# EAGLE design Quad VCA MAIN v1 (EAGLE 7.7.0)
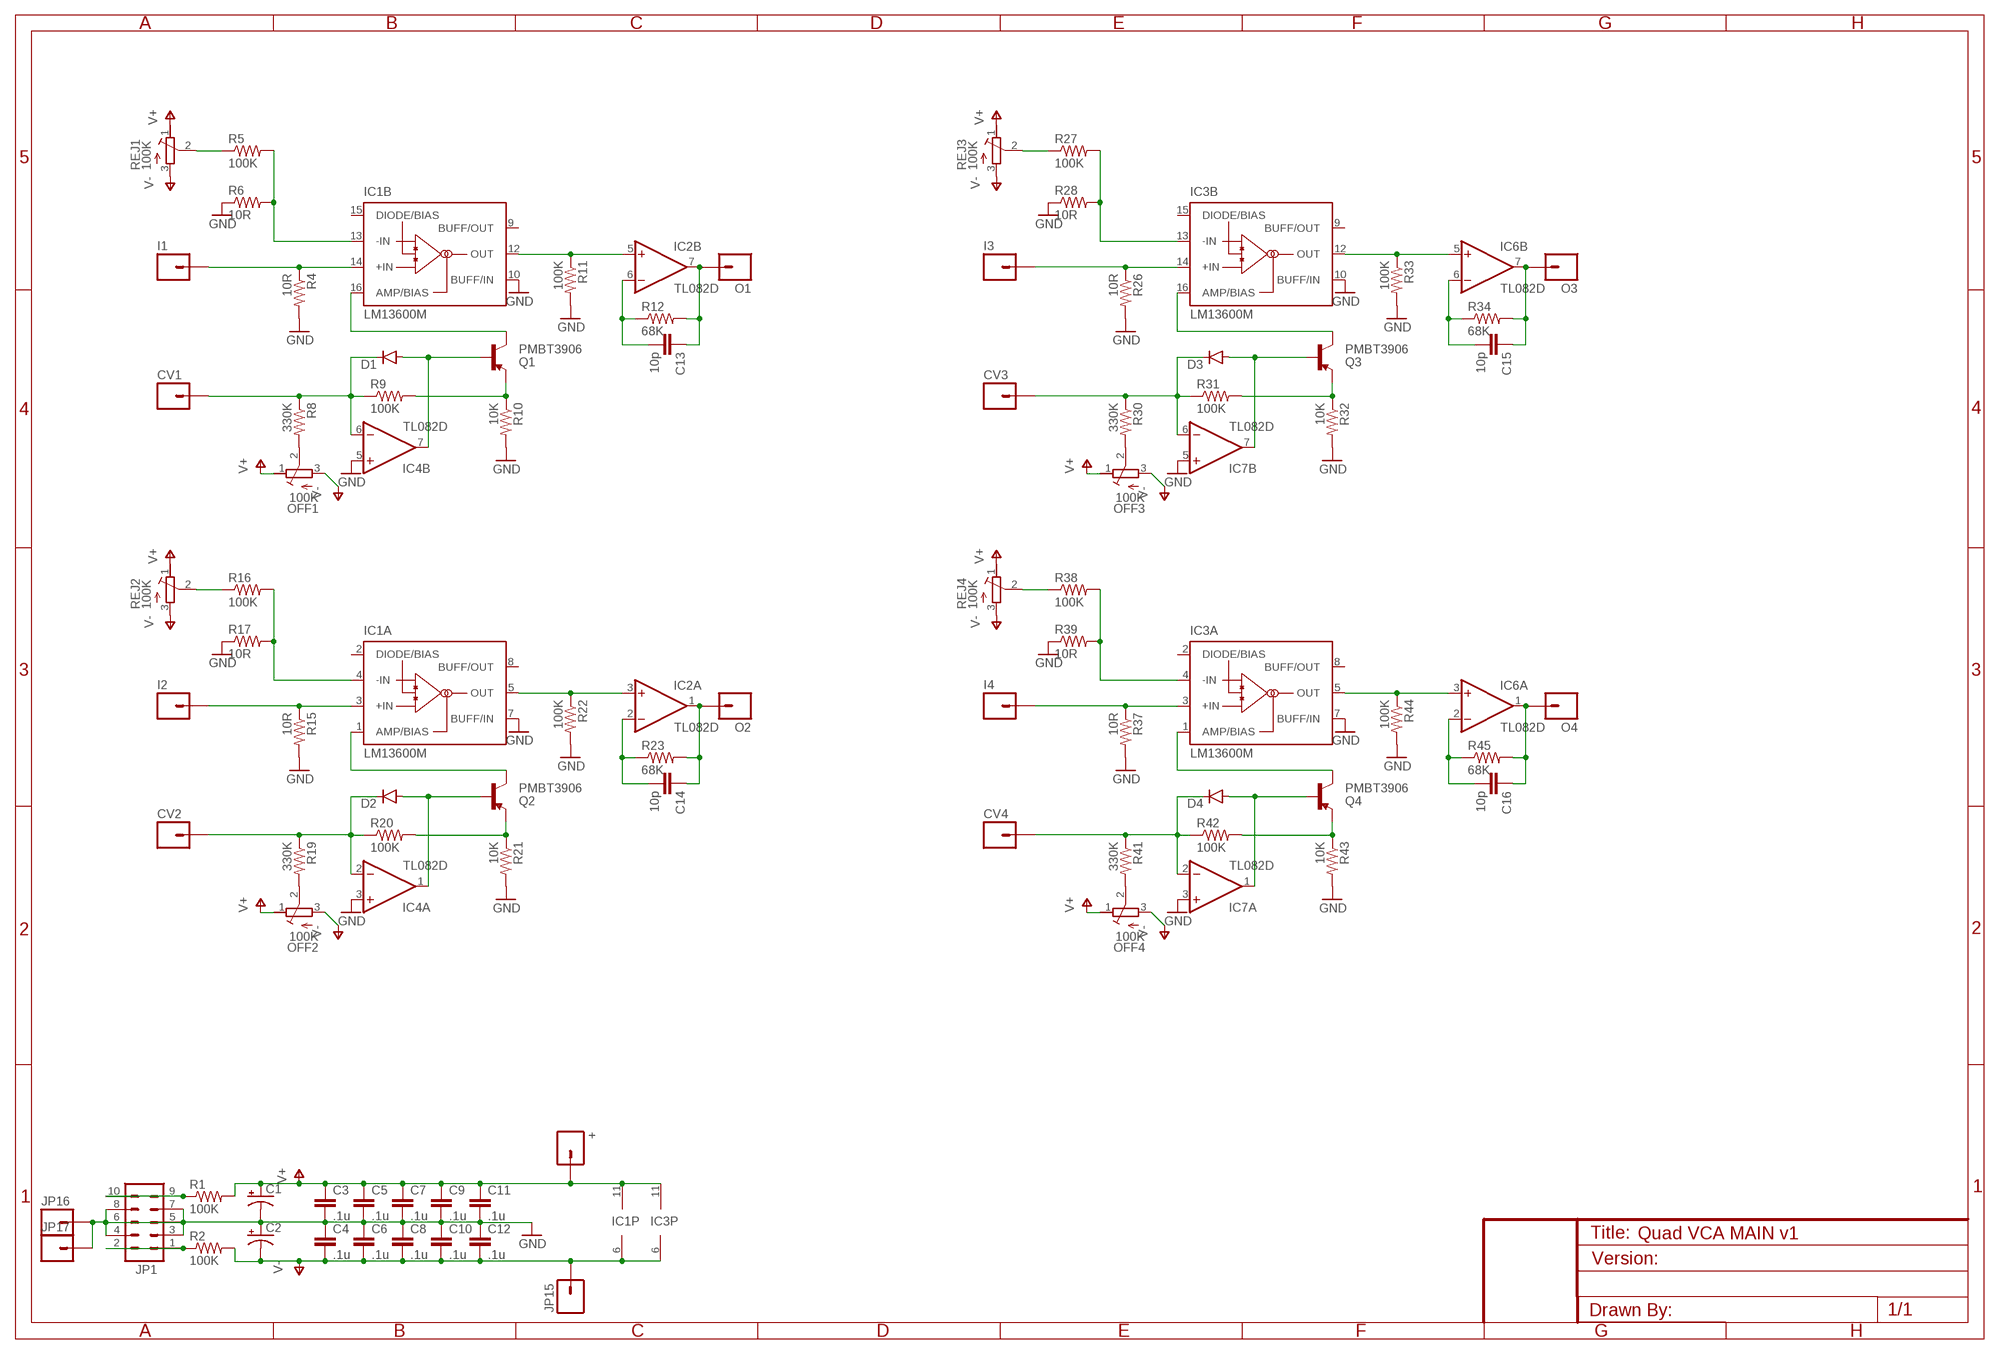
[diagram p0: schematic, sheet 1]

## Parts
+  M01PTH  [1X01]
C1  CAP_POLPTH2  [CPOL-RADIAL-10UF-25V]
C2  CAP_POLPTH2  [CPOL-RADIAL-10UF-25V]
C3  .1u  CAP0805  [0805]
C4  .1u  CAP0805  [0805]
C5  .1u  CAP0805  [0805]
C6  .1u  CAP0805  [0805]
C7  .1u  CAP0805  [0805]
C8  .1u  CAP0805  [0805]
C9  .1u  CAP0805  [0805]
C10  .1u  CAP0805  [0805]
C11  .1u  CAP0805  [0805]
C12  .1u  CAP0805  [0805]
C13  10p  CAP0805  [0805]
C14  10p  CAP0805  [0805]
C15  10p  CAP0805  [0805]
C16  10p  CAP0805  [0805]
CV1  M01PTH  [1X01]
CV2  M01PTH  [1X01]
CV3  M01PTH  [1X01]
CV4  M01PTH  [1X01]
D1  DIODESOD123  [SOD-123]
D2  DIODESOD123  [SOD-123]
D3  DIODESOD123  [SOD-123]
D4  DIODESOD123  [SOD-123]
I1  M01PTH  [1X01]
I2  M01PTH  [1X01]
I3  M01PTH  [1X01]
I4  M01PTH  [1X01]
IC1  LM13600M  [SO16]
IC2  TL082D  [SO08]
IC3  LM13600M  [SO16]
IC4  TL082D  [SO08]
IC6  TL082D  [SO08]
IC7  TL082D  [SO08]
JP1  M05X2PTH  [AVR_ICSP]
JP15  M01PTH  [1X01]
JP16  M01PTH  [1X01]
JP17  M01PTH  [1X01]
O1  M01PTH  [1X01]
O2  M01PTH  [1X01]
O3  M01PTH  [1X01]
O4  M01PTH  [1X01]
OFF1  100K  R-TRIMM3314G  [RTRIM3314G]
OFF2  100K  R-TRIMM3314G  [RTRIM3314G]
OFF3  100K  R-TRIMM3314G  [RTRIM3314G]
OFF4  100K  R-TRIMM3314G  [RTRIM3314G]
Q1  PMBT3906  TRANSISTOR_PNPPMBT3906  [SOT23-3]
Q2  PMBT3906  TRANSISTOR_PNPPMBT3906  [SOT23-3]
Q3  PMBT3906  TRANSISTOR_PNPPMBT3906  [SOT23-3]
Q4  PMBT3906  TRANSISTOR_PNPPMBT3906  [SOT23-3]
R1  100K  RESISTOR0805-RES  [0805]
R2  100K  RESISTOR0805-RES  [0805]
R4  10R  RESISTOR0805-RES  [0805]
R5  100K  RESISTOR0805-RES  [0805]
R6  10R  RESISTOR0805-RES  [0805]
R8  330K  RESISTOR0805-RES  [0805]
R9  100K  RESISTOR0805-RES  [0805]
R10  10K  RESISTOR0805-RES  [0805]
R11  100K  RESISTOR0805-RES  [0805]
R12  68K  RESISTOR0805-RES  [0805]
R15  10R  RESISTOR0805-RES  [0805]
R16  100K  RESISTOR0805-RES  [0805]
R17  10R  RESISTOR0805-RES  [0805]
R19  330K  RESISTOR0805-RES  [0805]
R20  100K  RESISTOR0805-RES  [0805]
R21  10K  RESISTOR0805-RES  [0805]
R22  100K  RESISTOR0805-RES  [0805]
R23  68K  RESISTOR0805-RES  [0805]
R26  10R  RESISTOR0805-RES  [0805]
R27  100K  RESISTOR0805-RES  [0805]
R28  10R  RESISTOR0805-RES  [0805]
R30  330K  RESISTOR0805-RES  [0805]
R31  100K  RESISTOR0805-RES  [0805]
R32  10K  RESISTOR0805-RES  [0805]
R33  100K  RESISTOR0805-RES  [0805]
R34  68K  RESISTOR0805-RES  [0805]
R37  10R  RESISTOR0805-RES  [0805]
R38  100K  RESISTOR0805-RES  [0805]
R39  10R  RESISTOR0805-RES  [0805]
R41  330K  RESISTOR0805-RES  [0805]
R42  100K  RESISTOR0805-RES  [0805]
R43  10K  RESISTOR0805-RES  [0805]
R44  100K  RESISTOR0805-RES  [0805]
R45  68K  RESISTOR0805-RES  [0805]
REJ1  100K  R-TRIMM3314G  [RTRIM3314G]
REJ2  100K  R-TRIMM3314G  [RTRIM3314G]
REJ3  100K  R-TRIMM3314G  [RTRIM3314G]
REJ4  100K  R-TRIMM3314G  [RTRIM3314G]

## Nets
GND: C1.2(-) C2.1(+) C3.2 C4.1 C5.2 C6.1 C7.2 C8.1 C9.2 C10.1 C11.2 C12.1 IC1.7(A:BUFF/IN) IC1.10(B:BUFF/IN) IC3.7(A:BUFF/IN) IC3.10(B:BUFF/IN) IC4.3(A:+IN) IC4.5(B:+IN) IC7.3(A:+IN) IC7.5(B:+IN) JP1.3 JP1.4 JP1.5 JP1.6 JP1.7 JP1.8 JP16.1 JP17.1 R4.2 R6.1 R10.2 R11.2 R15.2 R17.1 R21.2 R22.2 R26.2 R28.1 R32.2 R33.2 R37.2 R39.1 R43.2 R44.2
N$2: JP1.9 JP1.10 R1.1
N$4: I1.1 IC1.14(B:+IN) R4.1
N$5: JP1.1 JP1.2 R2.1
N$12: I2.1 IC1.3(A:+IN) R15.1
N$13: R16.1 REJ2.2(S)
N$14: IC1.4(A:-IN) R16.2 R17.2
N$15: OFF2.2(S) R19.2
N$16: CV2.1 D2.C IC4.2(A:-IN) R19.1 R20.1
N$17: Q2.2(E) R20.2 R21.1
N$18: D2.A IC4.1(A:OUT) Q2.1(B)
N$21: IC1.1(A:AMP/BIAS) Q2.3(C)
N$22: IC1.5(A:OUT) IC2.3(A:+IN) R22.1
N$23: C14.2 IC2.2(A:-IN) R23.1
N$24: C14.1 IC2.1(A:OUT) O2.1 R23.2
N$27: I3.1 IC3.14(B:+IN) R26.1
N$28: R27.1 REJ3.2(S)
N$29: IC3.13(B:-IN) R27.2 R28.2
N$30: OFF3.2(S) R30.2
N$31: CV3.1 D3.C IC7.6(B:-IN) R30.1 R31.1
N$32: Q3.2(E) R31.2 R32.1
N$33: D3.A IC7.7(B:OUT) Q3.1(B)
N$36: IC3.16(B:AMP/BIAS) Q3.3(C)
N$37: IC3.12(B:OUT) IC6.5(B:+IN) R33.1
N$38: C15.2 IC6.6(B:-IN) R34.1
N$39: R5.1 REJ1.2(S)
N$40: IC1.13(B:-IN) R5.2 R6.2
N$41: OFF1.2(S) R8.2
N$43: CV1.1 D1.C IC4.6(B:-IN) R8.1 R9.1
N$44: Q1.2(E) R9.2 R10.1
N$45: D1.A IC4.7(B:OUT) Q1.1(B)
N$47: IC1.16(B:AMP/BIAS) Q1.3(C)
N$48: IC1.12(B:OUT) IC2.5(B:+IN) R11.1
N$49: C13.2 IC2.6(B:-IN) R12.1
N$50: C13.1 IC2.7(B:OUT) O1.1 R12.2
N$52: C15.1 IC6.7(B:OUT) O3.1 R34.2
N$55: I4.1 IC3.3(A:+IN) R37.1
N$56: R38.1 REJ4.2(S)
N$57: IC3.4(A:-IN) R38.2 R39.2
N$58: OFF4.2(S) R41.2
N$59: CV4.1 D4.C IC7.2(A:-IN) R41.1 R42.1
N$60: Q4.2(E) R42.2 R43.1
N$61: D4.A IC7.1(A:OUT) Q4.1(B)
N$64: IC3.1(A:AMP/BIAS) Q4.3(C)
N$65: IC3.5(A:OUT) IC6.3(A:+IN) R44.1
N$66: C16.2 IC6.2(A:-IN) R45.1
N$67: C16.1 IC6.1(A:OUT) O4.1 R45.2
V+: +.1 C1.1(+) C3.1 C5.1 C7.1 C9.1 C11.1 IC1.11(P:V+) IC3.11(P:V+) OFF1.1(E) OFF2.1(E) OFF3.1(E) OFF4.1(E) R1.2 REJ1.1(E) REJ2.1(E) REJ3.1(E) REJ4.1(E)
V-: C2.2(-) C4.2 C6.2 C8.2 C10.2 C12.2 IC1.6(P:V-) IC3.6(P:V-) JP15.1 OFF1.3(A) OFF2.3(A) OFF3.3(A) OFF4.3(A) R2.2 REJ1.3(A) REJ2.3(A) REJ3.3(A) REJ4.3(A)
Unconnected: IC1.2(A:DIODE/BIAS) IC1.8(A:BUFF/OUT) IC1.9(B:BUFF/OUT) IC1.15(B:DIODE/BIAS) IC3.2(A:DIODE/BIAS) IC3.8(A:BUFF/OUT) IC3.9(B:BUFF/OUT) IC3.15(B:DIODE/BIAS)

## Power pins joined to a net without a drawn wire
V+: IC2.8(P:V+) IC4.8(P:V+) IC6.8(P:V+) IC7.8(P:V+)
V-: IC2.4(P:V-) IC4.4(P:V-) IC6.4(P:V-) IC7.4(P:V-)

## Library data of the parts
+ CV1-CV4 I1-I4 JP15-JP17 O1-O4 = SparkFun-Connectors:M01: Header 1 Standard 1-pin 0.1" header. Use with straight break away headers (SKU : PRT-00116), right angle break away headers (PRT-00553), swiss pins (PRT-00743), machine pins (PRT-00117), and female headers (PRT-00115).
C1 C2 = SparkFun-Passives:CAP_POL: Capacitor Polarized These are standard SMD and PTH capacitors. Normally 10uF, 47uF, and 100uF in electrolytic and tantalum varieties. Always verify the external diameter of the through hole cap, it varies with capacity, voltage, and manufacturer. The EIA devices should be standard.
C3-C16 = SparkFun-Capacitors:CAP: Capacitor Standard 0603 ceramic capacitor, and 0.1" leaded capacitor.
D1-D4 = SparkFun-DiscreteSemi:DIODE: Diode These are standard reverse protection diodes and small signal diodes. SMA package can handle up to about 1A. SOD-323 can handle about 200mA. What the SOD-323 package when ordering, there are some mfgs out there that are 5-pin packages.
IC1 IC3 = national-semiconductor:LM13600: Dual Operational Transconductance Amplifiers with Linearizing Diodes and Buffers Source: lm13600.PDF
IC2 IC4 IC6 IC7 = linear:TL082: OP AMP Data sheet <http://www.ti.com/lit/ds/symlink/tl084a . pdf>; DATA_SHEET: <a href="http://www.ti.com/lit/ds/symlink/tl084a.pdf"> Data sheet </a>
JP1 = SparkFun-Connectors:M05X2: Header 5x2 Standard 10-pin dual row 0.1" header. Commonly used with AVR-ISP. Use with Spark Fun Electronics SKU: PRT-00778
OFF1-OFF4 REJ1-REJ4 = rcl:R-TRIMM: Trimm resistor
Q1-Q4 = SparkFun-DiscreteSemi:TRANSISTOR_PNP: Generic PNP BJT Double check pinouts against datasheets- not all devices are the same! MMBT3906 - 40V 200mA SOT-23 (TRANS-08052) MMBT4403 - 40V 600mA SOT-23 (TRANS-09245); PROD_ID: TRANS-08052
R1 R2 R4-R6 R8-R12 R15-R17 R19-R23 R26-R28 R30-R34 R37-R39 R41-R45 = SparkFun-Resistors:RESISTOR: Resistor Basic schematic elements and footprints for 0603, 1206, and PTH resistors.

## Board
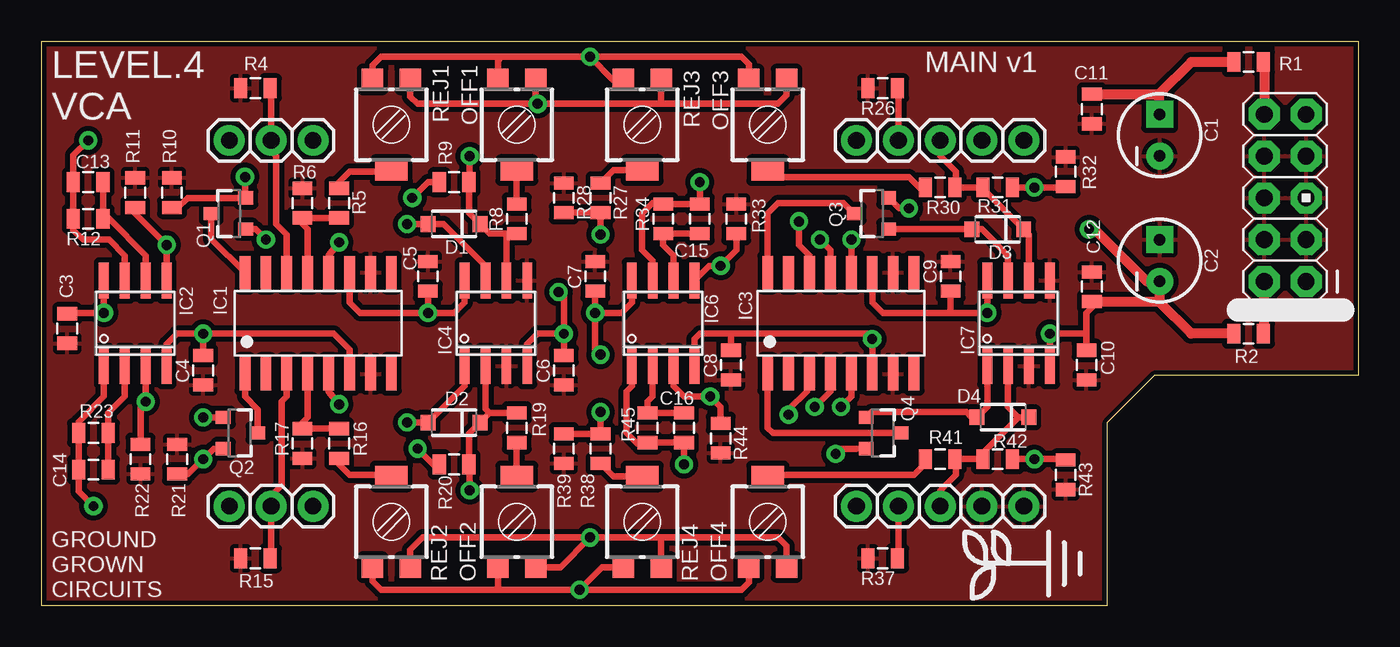
[diagram p1: board, top side]
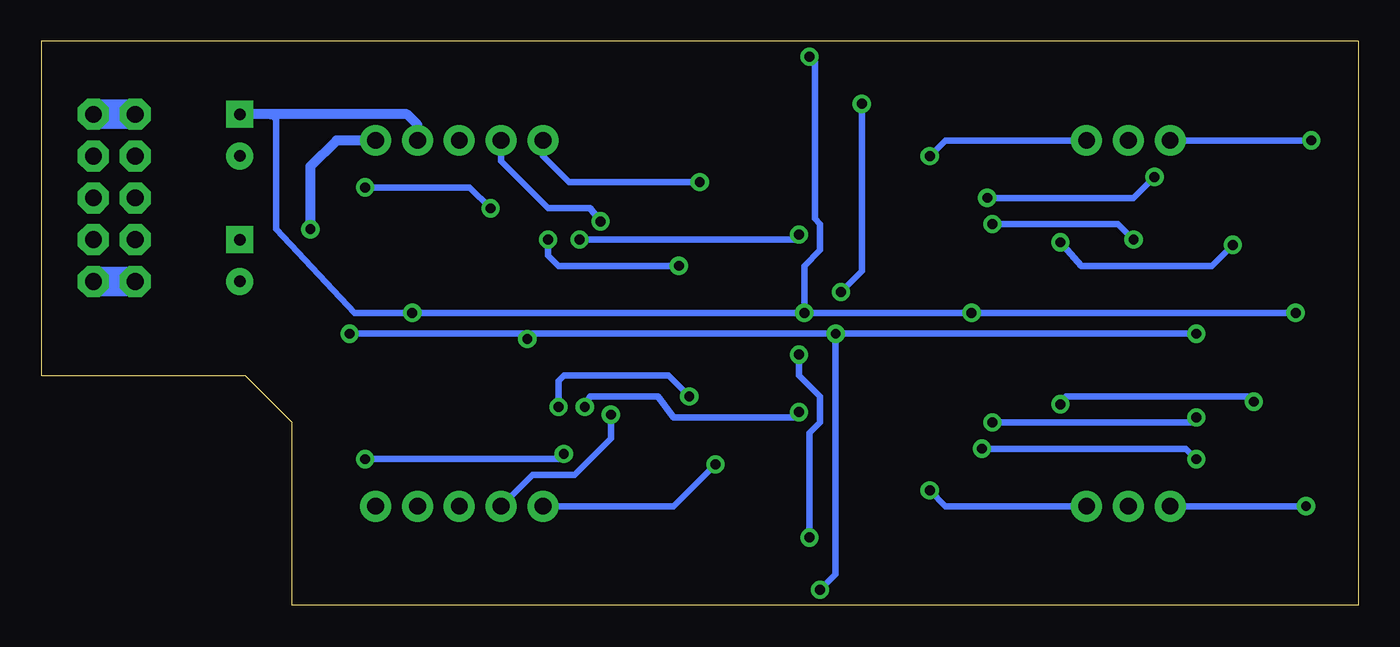
[diagram p2: board, bottom side, seen from below]

Size 80.01 x 34.29 mm. Coordinates in mm from the lower left corner, seen from the top.
Outline: 0,0 64.77,0 64.77,11.11 67.63,13.97 80.01,13.97 80.01,34.29 0,34.29 0,0
Copper layers (1*16): Top 0.035mm / dielectric 1.5mm / Bottom 0.035mm
Design rules "SparkFun": minimum track width 8mil, minimum drill 20mil, track to track 8mil, track to pad 8mil, pad to pad 8mil, via to via 8mil, smd to smd 8mil, copper to edge 8mil, drill to drill 8mil, minimum pad ring 12mil, minimum via ring 10mil, stop-mask expansion 4mil, vias tented up to drill 20mil, thermal gap 10mil

### Footprints (pad centres in the part's own frame; a part is rotated, then mirrored left to right if it is on the bottom)
1X01 = drill 1.016 pad 1.88: 1 0,0
CPOL-RADIAL-10UF-25V = drill 0.7 pad 1.651 square: 1 1.27,0 | drill 0.7 pad 1.651: 2 -1.27,0
0805 = smd 0.8 x 1.2: 1 -0.9,0; 2 0.9,0
SOD-123 = smd 0.9 x 0.95: A 1.575,0; C -1.575,0
SO16 = smd 0.66 x 2.032: 1 -4.445,-3.073; 2 -3.175,-3.073; 3 -1.905,-3.073; 4 -0.635,-3.073; 5 0.635,-3.073; 6 1.905,-3.073; 7 3.175,-3.073; 8 4.445,-3.073; 9 4.445,3.073; 10 3.175,3.073; 11 1.905,3.073; 12 0.635,3.073; 13 -0.635,3.073; 14 -1.905,3.073; 15 -3.175,3.073; 16 -4.445,3.073
SO08 = smd 0.6 x 2.2: 1 -1.905,-2.6; 2 -0.635,-2.6; 3 0.635,-2.6; 4 1.905,-2.6; 5 1.905,2.6; 6 0.635,2.6; 7 -0.635,2.6; 8 -1.905,2.6
AVR_ICSP = drill 1.016 pad 1.88 octagon: 1 -1.27,5.08; 2 1.27,5.08; 3 -1.27,2.54; 4 1.27,2.54; 5 -1.27,0; 6 1.27,0; 7 -1.27,-2.54; 8 1.27,-2.54; 9 -1.27,-5.08; 10 1.27,-5.08
RTRIM3314G = smd 1.3 x 1.3: 1 1.15,-2.75; 3 -1.15,-2.75 | smd 2 x 1.3: 2 0,2.75
SOT23-3 = smd 0.8 x 0.9: 1 -0.95,-1; 2 0.95,-1; 3 0,1.1

### Placement (x,y rotation side)
+  57.15,28.26 0 top
C1  67.94,28.57 90 top
C2  67.94,20.95 90 top
C3  1.59,16.83 270 top
C4  9.84,14.29 90 top
C5  23.5,20 90 top
C6  31.75,14.29 90 top
C7  33.66,20 90 top
C8  41.91,14.61 90 top
C9  55.24,20 90 top
C10  63.5,14.61 90 top
C11  63.82,30.16 270 top
C12  63.82,19.37 270 top
C13  2.86,25.72 0 top
C14  3.17,8.26 0 top
C15  40.01,23.5 270 top
C16  39.05,10.79 90 top
CV1  16.51,28.26 0 top
CV2  16.51,6.03 0 top
CV3  54.61,28.26 0 top
CV4  54.61,6.03 0 top
D1  25.08,23.18 180 top
D2  25.08,11.11 180 top
D3  58.1,22.86 180 top
D4  58.42,11.43 180 top
I1  13.97,28.26 0 top
I2  13.97,6.03 0 top
I3  52.07,28.26 0 top
I4  52.07,6.03 0 top
IC1  16.83,17.14 0 top
IC2  5.71,17.14 0 top
IC3  48.58,17.14 0 top
IC4  27.62,17.14 0 top
IC6  37.78,17.14 0 top
IC7  59.37,17.14 0 top
JP1  75.56,24.77 180 top
JP15  59.69,28.26 0 top
JP16  59.69,6.03 0 top
JP17  57.15,6.03 0 top
O1  11.43,28.26 0 top
O2  11.43,6.03 0 top
O3  49.53,28.26 0 top
O4  49.53,6.03 0 top
OFF1  28.89,29.21 180 top
OFF2  28.89,5.08 0 top
OFF3  44.13,29.21 180 top
OFF4  44.13,5.08 0 top
Q1  11.43,23.81 90 top
Q2  12.06,10.48 270 top
Q3  50.48,23.81 90 top
Q4  51.12,10.48 270 top
R1  73.34,33.02 180 top
R2  73.34,16.51 180 top
R4  13.02,31.43 180 top
R5  18.1,24.45 270 top
R6  15.88,24.45 270 top
R8  28.89,23.5 90 top
R9  25.08,25.72 180 top
R10  7.94,25.08 90 top
R11  5.71,25.08 90 top
R12  2.86,23.5 180 top
R15  13.02,2.86 180 top
R16  18.1,9.84 90 top
R17  15.88,9.84 90 top
R19  28.89,10.79 270 top
R20  25.08,8.57 180 top
R21  8.26,8.89 90 top
R22  6.03,8.89 270 top
R23  3.17,10.48 180 top
R26  51.12,31.43 180 top
R27  33.97,24.77 270 top
R28  31.75,24.77 270 top
R30  54.61,25.4 180 top
R31  58.1,25.4 0 top
R32  62.23,26.35 90 top
R33  42.23,23.5 90 top
R34  37.78,23.5 90 top
R37  51.12,2.86 180 top
R38  33.97,9.53 90 top
R39  31.75,9.53 90 top
R41  54.61,8.89 180 top
R42  58.1,8.89 0 top
R43  62.23,7.94 270 top
R44  41.27,10.16 270 top
R45  36.83,10.79 270 top
REJ1  21.27,29.21 180 top
REJ2  21.27,5.08 0 top
REJ3  36.51,29.21 180 top
REJ4  36.51,5.08 0 top
U$1  [LOGO_SMALL]  61.12,2.54 90 top

### Tracks (layer width: path | path; a pad name or v marks a point on that pad's centre or on a via)
GND
  pour Top (isolate 0.305): 0,0 64.77,0 64.77,11.11 67.63,13.97 80.01,13.97 80.01,34.29 0,34.29
N$2
  Top 0.61: R1.1 74.3,33.02 JP1.10
  Bottom 1.778: JP1.9 JP1.10
N$4
  Top 0.406: R4.1 13.97,31.38 I1.1 13.97,27.62 14.29,27.3 14.29,23.18 14.92,22.54 IC1.14
N$5
  Top 0.61: R2.1 74.3,16.51 JP1.2
  Bottom 1.778: JP1.1 JP1.2
N$12
  Top 0.406: R15.1 13.97,2.91 I2.1 13.97,6.67 14.61,7.3 14.61,12.38 14.92,12.7 IC1.3
N$13
  Top 0.406: R16.1 18.1,8.57 18.73,7.94 21.16,7.94 REJ2.2
N$14
  Top 0.406: R16.2 R17.2 15.88,11.11 16.19,11.43 IC1.4
N$15
  Top 0.406: OFF2.2 R19.2
N$16  (via drill 0.6)
  Top 0.406: v26.04,6.99 26.04,8.52 R20.1 25.98,10.44 D2.C 27.24,11.7 | R19.1 27.24,11.7 | IC4.2 26.99,11.95 27.24,11.7
  Bottom 0.406: CV2.1 25.08,6.03 v26.04,6.99
N$17  (via drill 0.6)
  Top 0.406: R20.2 23.81,8.57 v22.86,9.53 | Q2.2 10.48,9.53 v9.84,8.89 8.94,7.99 R21.1
  Bottom 0.406: v22.86,9.53 10.48,9.53 v9.84,8.89
N$18  (via drill 0.6)
  Top 0.406: IC4.1 25.72,13.32 D2.A v22.23,11.11 | v9.84,11.43 Q2.1
  Bottom 0.406: v22.23,11.11 10.16,11.11 v9.84,11.43
N$21
  Top 0.406: Q2.3 13.16,11.92 12.38,12.7 IC1.1
N$22  (via drill 0.6)
  Top 0.406: IC1.5 17.46,13.02 v18.1,12.22 | IC2.3 v6.35,12.38 6.03,12.06 R22.1
  Bottom 0.406: v18.1,12.22 17.78,12.7 6.67,12.7 v6.35,12.38
N$23
  Top 0.406: C14.2 R23.1 4.08,11.7 5.08,12.7 IC2.2
N$24  (via drill 0.6)
  Top 0.406: IC2.1 3.81,12.7 2.27,11.16 R23.2 C14.1 2.27,6.93 v3.17,6.03
  Bottom 0.406: v3.17,6.03 O2.1
N$27  (via drill 0.6)
  Top 0.406: I3.1 52.07,31.38 R26.1 | v46.04,23.34 46.04,21.91 46.67,21.27 IC3.14
  Bottom 0.406: I3.1 52.07,26.99 49.21,24.13 46.67,24.13 v46.04,23.34
N$28
  Top 0.406: REJ3.2 34.77,26.46 R27.1
N$29  (via drill 0.6)
  Top 0.406: R28.2 R27.2 v33.97,22.54 | IC3.13 47.94,21.59 v47.31,22.23
  Bottom 0.406: v47.31,22.23 34.29,22.23 v33.97,22.54
N$30
  Top 0.406: R30.2 53.34,25.4 52.7,26.04 44.56,26.04 OFF3.2
N$31
  Top 0.406: CV3.1 54.61,27.3 55.56,26.35 55.56,25.45 R30.1 R31.1 57.2,25.34 D3.C 60.01,22.53 IC7.6
N$32  (via drill 0.6)
  Top 0.406: R31.2 v60.33,25.4 62.18,25.4 R32.1 | v52.7,24.13 52.12,24.13 Q3.2
  Bottom 0.406: v60.33,25.4 53.98,25.4 v52.7,24.13
N$33
  Top 0.406: IC7.7 58.74,21.27 57.15,22.86 D3.A Q3.1
N$36
  Top 0.406: IC3.16 44.13,23.81 44.77,24.45 48.75,24.45 Q3.3
N$37  (via drill 0.6)
  Top 0.406: IC3.12 v49.21,22.23 | IC6.5 40.58,20.64 v41.27,20.64 42.23,21.59 R33.1
  Bottom 0.406: v49.21,22.23 49.21,21.27 48.58,20.64 v41.27,20.64
N$38
  Top 0.406: C15.2 R34.1 37.78,21.91 38.42,21.27 IC6.6
N$39
  Top 0.406: R5.1 18.1,25.72 18.73,26.35 21.16,26.35 REJ1.2
N$40
  Top 0.406: R5.2 R6.2 15.88,23.18 16.19,22.86 IC1.13
N$41
  Top 0.406: OFF1.2 R8.2
N$43  (via drill 0.6)
  Top 0.406: R8.1 28.26,22.59 | 28.26,22.59 27.24,22.59 D1.C 25.98,23.85 R9.1 26.04,25.77 v26.04,27.3 | IC4.6 28.26,22.59
  Bottom 0.406: CV1.1 25.08,28.26 v26.04,27.3
N$44  (via drill 0.6)
  Top 0.406: R9.2 23.5,25.72 v22.54,24.77 | v12.38,26.04 12.38,24.81 Q1.2 8.89,24.77 8.31,24.18 R10.1
  Bottom 0.406: v22.54,24.77 13.65,24.77 v12.38,26.04
N$45  (via drill 0.6)
  Top 0.406: IC4.7 26.99,20.64 24.45,23.18 D1.A v22.23,23.18 | v13.65,22.23 13.02,22.86 Q1.1
  Bottom 0.406: v22.23,23.18 14.61,23.18 v13.65,22.23
N$47
  Top 0.406: Q1.3 10.33,22.27 IC1.16
N$48  (via drill 0.6)
  Top 0.406: IC1.12 17.46,21.27 v18.1,22.07 | IC2.5 v7.62,21.91 5.71,23.81 R11.1
  Bottom 0.406: v18.1,22.07 16.83,20.64 8.89,20.64 v7.62,21.91
N$49
  Top 0.406: C13.2 R12.1 4.13,23.5 6.35,21.27 IC2.6
N$50  (via drill 0.6)
  Top 0.406: IC2.7 5.08,21.27 4.13,22.23 2.54,22.23 1.96,22.81 R12.2 C13.1 1.96,27.36 v2.86,28.26
  Bottom 0.406: v2.86,28.26 O1.1
N$52  (via drill 0.6)
  Top 0.406: IC6.7 37.15,20.95 36.51,21.59 36.51,23.81 37.15,24.45 37.73,24.45 R34.2 C15.1 v40.01,25.72
  Bottom 0.406: O3.1 49.53,27.3 47.94,25.72 v40.01,25.72
N$55  (via drill 0.6)
  Top 0.406: I4.1 52.07,2.91 R37.1 | IC3.3 46.67,13.34 46.51,13.02 45.4,11.91 v45.4,11.59 45.4,11.75
  Bottom 0.406: v45.4,11.59 45.4,10.16 47.62,7.94 50.16,7.94 I4.1
N$56
  Top 0.406: REJ4.2 34.77,7.83 R38.1
N$57  (via drill 0.6)
  Top 0.406: R39.2 R38.2 v33.97,11.75 | IC3.4 47.94,13.02 v46.99,12.06
  Bottom 0.406: v46.99,12.06 46.67,12.7 42.55,12.7 41.59,11.43 34.29,11.43 v33.97,11.75
N$58
  Top 0.406: R41.2 53.71,8.62 53.02,7.94 44.24,7.94 OFF4.2
N$59
  Top 0.406: 59.37,11.43 57.2,9.26 R42.1 R41.1 55.56,8.84 55.56,7.94 54.61,6.99 CV4.1 | IC7.2 58.74,12.06 59.37,11.43 | D4.C 59.37,11.43
N$60  (via drill 0.6)
  Top 0.406: R42.2 v60.33,8.89 62.18,8.89 R43.1 | Q4.2 49.48,9.53 48.58,9.53 v48.26,9.21
  Bottom 0.406: v60.33,8.89 48.58,8.89 v48.26,9.21
N$61
  Top 0.406: IC7.1 57.47,12.05 D4.A 56.52,11.43 56.2,11.75 50.44,11.75 Q4.1
N$64
  Top 0.406: Q4.3 44.45,10.48 44.13,10.79 IC3.1
N$65  (via drill 0.6)
  Top 0.406: IC3.5 49.21,12.7 v48.58,12.06 | R44.1 41.27,12.06 v40.64,12.7 39.05,12.7 38.42,13.34 IC6.3
  Bottom 0.406: v48.58,12.06 48.58,13.65 48.26,13.97 41.91,13.97 v40.64,12.7
N$66
  Top 0.406: IC6.2 37.15,12.7 36.83,12.38 R45.1 C16.2
N$67  (via drill 0.6)
  Top 0.406: IC6.1 35.88,13.34 35.56,13.02 35.56,10.48 36.2,9.84 36.78,9.84 R45.2 C16.1 v39.05,8.57
  Bottom 0.406: O4.1 41.59,6.03 v39.05,8.57
V+  (via drill 0.6)
  Top 0.406: IC7.8 v57.47,17.78 55.24,17.78 | IC2.8 v3.81,17.78 1.91,17.78 C3.1 | IC3.11 50.48,18.41 51.12,17.78 55.24,17.78 | C9.1 55.24,17.78 | IC1.11 18.73,18.41 19.37,17.78 v23.5,17.78 | C5.1 v23.5,17.78 | v23.5,17.78 25.08,17.78 25.72,18.41 IC4.8 | C7.1 v33.66,17.78 | IC6.8 35.88,18.41 35.24,17.78 v33.66,17.78 | REJ3.1 34.72,31.96 v33.34,33.34 | REJ1.1 20.12,32.82 20.64,33.34 27.94,33.34 | 27.94,33.34 v33.34,33.34 | OFF3.1 42.98,32.9 42.55,33.34 v33.34,33.34 | OFF1.1 27.74,33.14 27.94,33.34 | OFF2.1 31.54,2.33 v33.34,4.13 | v33.97,15.24 33.66,15.56 v33.66,17.78 | OFF4.1 45.28,3.61 44.77,4.13 37.78,4.13 | 37.78,4.13 v33.34,4.13 | REJ4.1 37.66,4.01 37.78,4.13 | REJ2.1 22.42,3.37 23.18,4.13 v33.34,4.13
  Top 0.61: R1.2 69.85,33.02 67.89,31.06 | C11.1 67.89,31.06 | 67.89,31.06 67.89,29.9 C1.1
  Bottom 0.406: 66.04,29.84 65.72,29.53 65.72,22.86 60.96,17.78 v57.47,17.78 v33.66,17.78 | v3.81,17.78 v23.5,17.78 v33.66,17.78 | v33.34,33.34 33.02,33.02 33.02,23.5 32.7,23.18 32.7,21.59 33.66,20.64 v33.66,17.78 | v33.34,4.13 33.34,10.48 32.7,11.11 32.7,12.7 33.97,13.97 v33.97,15.24
  Bottom 0.61: +.1 57.15,29.21 57.78,29.84 66.04,29.84 C1.1
V-  (via drill 0.6)
  Top 0.406: C12.2 63.82,18.1 63.5,17.78 63.5,16.51 | 63.5,16.51 v61.28,16.51 IC7.4 | IC2.4 7.62,15.88 8.26,16.51 v9.84,16.51 | C10.2 63.5,16.51 | C4.2 v9.84,16.51 | IC3.6 v50.48,16.19 50.16,16.51 41.91,16.51 | C8.2 41.91,16.51 | 41.91,16.51 40.01,16.51 39.69,16.19 IC6.4 | IC1.6 18.73,15.56 17.78,16.51 v9.84,16.51 | C6.2 v31.75,16.51 | IC4.4 29.53,15.88 30.16,16.51 v31.75,16.51 | OFF1.3 30.04,30.6 v30.16,30.48 | v31.43,19.05 31.75,18.73 v31.75,16.51 | REJ1.3 22.42,30.92 22.86,30.48 v30.16,30.48 | REJ3.3 37.66,30.6 37.78,30.48 | 37.78,30.48 v30.16,30.48 | OFF3.3 45.28,31 44.77,30.48 37.78,30.48 | REJ4.3 34.08,2.33 v32.7,0.95 | REJ2.3 20.12,1.47 20.64,0.95 27.62,0.95 | 27.62,0.95 v32.7,0.95 | OFF2.3 27.74,1.07 27.62,0.95 | OFF4.3 42.98,1.39 42.55,0.95 v32.7,0.95
  Top 0.61: C12.2 67.89,18.47 67.94,18.41 | 67.94,18.41 C2.2 67.15,19.68 63.98,22.86 v63.66,22.86 | R2.2 69.85,16.51 67.94,18.41
  Bottom 0.406: v9.84,16.51 v31.75,16.51 | v31.75,16.51 50.48,16.51 | 50.48,16.51 v61.28,16.51 | v50.48,16.19 50.48,16.51 | v30.16,30.48 30.16,20.32 v31.43,19.05 | v32.7,0.95 31.75,1.91 v31.75,16.51
  Bottom 0.61: JP15.1 62.07,28.26 63.66,26.67 v63.66,22.86

### Text on the board
tPlace: MAIN v1 | LEVEL.4 / VCA | GROUND / GROWN / CIRCUITS